# EAGLE design ppm_encoder_402_crystal (EAGLE 5.07)
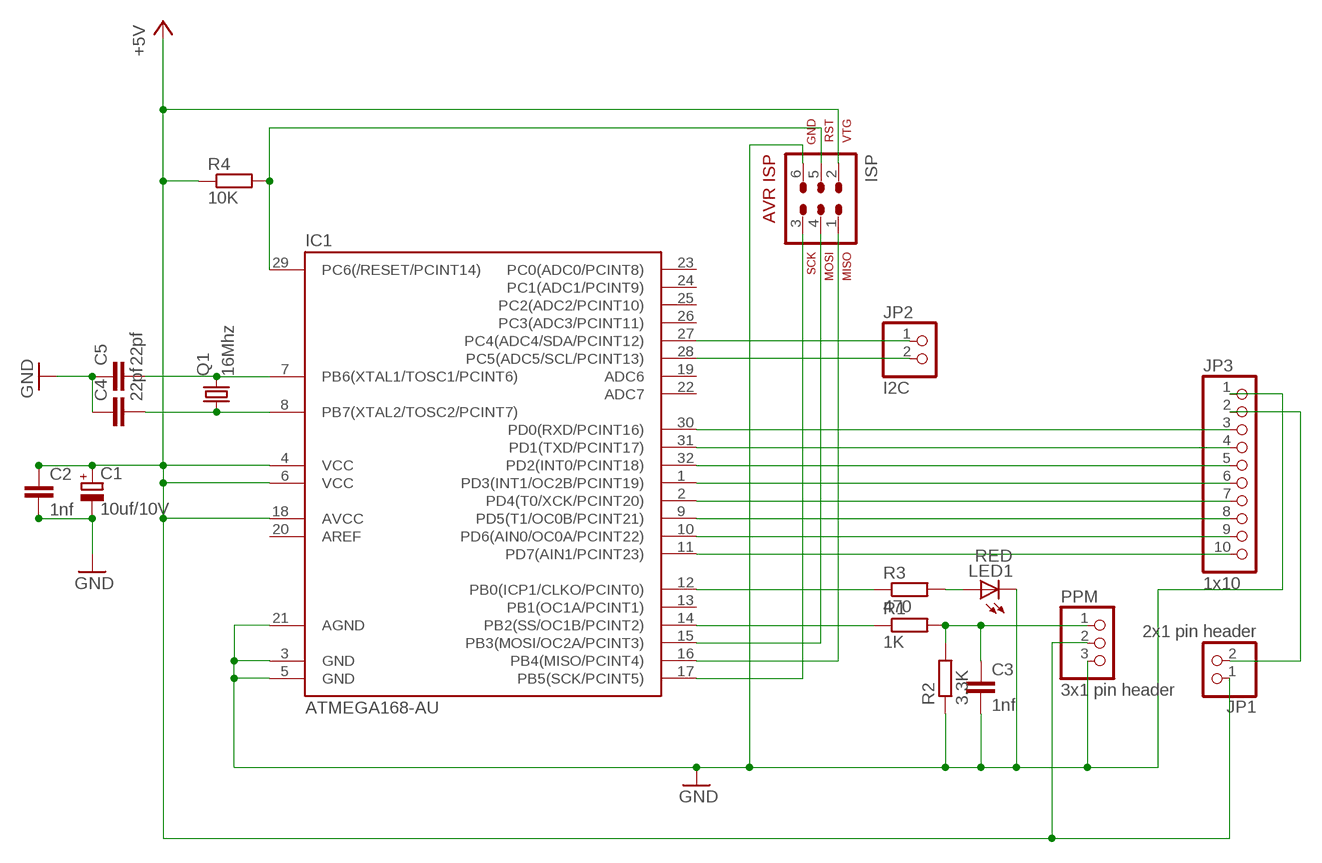
[diagram p0: schematic, sheet 1]

## Parts
C1  10uf/10V  CPOL-EUB/3528-21R  [B/3528-21R]
C2  1nf  C-EUC0402  [C0402]
C3  1nf  C-EUC0402  [C0402]
C4  22pf  C-EUC0402  [C0402]
C5  22pf  C-EUC0402  [C0402]
IC1  ATMEGA168-AU  MEGA48/88/168-AU  [TQFP32-08]
ISP  AVR-ISP-6  [AVR-ISP-6]
JP1  2x1 pin header  PINHD-1X2  [1X02]
JP2  I2C  PINHD-1X2  [1X02]
JP3  1x10  PINHD-1X10/90  [1X10/90]
LED1  RED  LEDCHIP-LED0603  [CHIP-LED0603]
PPM  3x1 pin header  PINHD-1X3  [1X03]
Q1  16Mhz  CRYSTALCTS406  [CTS406]
R1  1K  R-EU_R0402  [R0402]
R2  3.3K  R-EU_R0402  [R0402]
R3  470  R-EU_R0402  [R0402]
R4  10K  R-EU_R0402  [R0402]

## Nets
+5V: C1.+ C2.1 IC1.4(VCC) IC1.6(VCC) IC1.18(AVCC) ISP.2 JP1.1 PPM.2 R4.1
GND: C1.- C2.2 C3.2 C4.1 C5.1 IC1.3(GND) IC1.5(GND) IC1.21(AGND) ISP.6 JP3.1 LED1.C PPM.3 R2.1
N$1: IC1.30(PD0(RXD/PCINT16)) JP3.3
N$2: IC1.31(PD1(TXD/PCINT17)) JP3.4
N$3: IC1.32(PD2(INT0/PCINT18)) JP3.5
N$4: IC1.1(PD3(INT1/OC2B/PCINT19)) JP3.6
N$5: IC1.2(PD4(T0/XCK/PCINT20)) JP3.7
N$6: IC1.9(PD5(T1/OC0B/PCINT21)) JP3.8
N$7: IC1.10(PD6(AIN0/OC0A/PCINT22)) JP3.9
N$8: IC1.11(PD7(AIN1/PCINT23)) JP3.10
N$9: IC1.12(PB0(ICP1/CLKO/PCINT0)) R3.1
N$10: IC1.14(PB2(SS/OC1B/PCINT2)) R1.1
N$11: C3.1 PPM.1 R1.2 R2.2
N$12: LED1.A R3.2
N$13: IC1.16(PB4(MISO/PCINT4)) ISP.1
N$14: IC1.15(PB3(MOSI/OC2A/PCINT3)) ISP.4
N$15: IC1.17(PB5(SCK/PCINT5)) ISP.3
N$16: IC1.29(PC6(/RESET/PCINT14)) ISP.5 R4.2
N$17: C5.2 IC1.7(PB6(XTAL1/TOSC1/PCINT6)) Q1.3
N$18: IC1.28(PC5(ADC5/SCL/PCINT13)) JP2.2
N$19: C4.2 IC1.8(PB7(XTAL2/TOSC2/PCINT7)) Q1.1
N$20: IC1.27(PC4(ADC4/SDA/PCINT12)) JP2.1
N$21: JP1.2 JP3.2
Unconnected: IC1.13(PB1(OC1A/PCINT1)) IC1.19(ADC6) IC1.20(AREF) IC1.22(ADC7) IC1.23(PC0(ADC0/PCINT8)) IC1.24(PC1(ADC1/PCINT9)) IC1.25(PC2(ADC2/PCINT10)) IC1.26(PC3(ADC3/PCINT11))

## Library data of the parts
C1 = rcl:CPOL-EU: POLARIZED CAPACITOR, European symbol
C2-C5 = rcl:C-EU: CAPACITOR, European symbol
IC1 = avr-4:MEGA48/88/168
ISP = avr-4:AVR-ISP-6: AVR ISP-6 Serial Programming Header
JP1 JP2 = pinhead:PINHD-1X2: PIN HEADER
JP3 = pinhead:PINHD-1X10: PIN HEADER
LED1 = led:LED: LED OSRAM: - CHIPLED LG R971, LG N971, LY N971, LG Q971, LY Q971, LO R971, LY R971 LH N974, LH R974 LS Q976, LO Q976, LY Q976 LO Q996 - Hyper CHIPLED LW Q18S LB Q993, LB Q99A, LB R99A - SideLED LS A670, LO A670, LY A670, LG A670, LP A670 LB A673, LV A673, LT A673, LW A673 LH A674 LY A675 LS A676, LA A676, LO A676, LY A676, LW A676 LS A679, LY A679, LG A679 - Hyper Micro SIDELED® LS Y876, LA Y876, LO Y876, LY Y876 LT Y87S - SmartLED LW L88C, LW L88S LB L89C, LB L89S, LG L890 LS L89K, LO L89K, LY L89K LS L896, LA L896, LO L896, LY L896 - TOPLED LS T670, LO T670, LY T670, LG T670, LP T670 LSG T670, LSP T670, LSY T670, LOP T670, LYG T670 LG T671, LOG T671, LSG T671 LB T673, LV T673, LT T673, LW T673 LH T674 LS T676, LA T676, LO T676, LY T676, LB T676, LH T676, LSB T676, LW T676 LB T67C, LV T67C, LT T67C, LS T67K, LO T67K, LY T67K, LW E67C LS E67B, LA E67B, LO E67B, LY E67B, LB E67C, LV E67C, LT E67C LW T67C LS T679, LY T679, LG T679 LS T770, LO T770, LY T770, LG T770, LP T770 LB T773, LV T773, LT T773, LW T773 LH T774 LS E675, LA E675, LY E675, LS T675 LS T776, LA T776, LO T776, LY T776, LB T776 LHGB T686 LT T68C, LB T68C - Hyper Mini TOPLED® LB M676 - Mini TOPLED Santana® LG M470 LS M47K, LO M47K, LY M47K Source: http://www.osram.convergy.de LUXEON: - LUMILED® LXK2-PW12-R00, LXK2-PW12-S00, LXK2-PW14-U00, LXK2-PW14-V00 LXK2-PM12-R00, LXK2-PM12-S00, LXK2-PM14-U00 LXK2-PE12-Q00, LXK2-PE12-R00, LXK2-PE12-S00, LXK2-PE14-T00, LXK2-PE14-U00 LXK2-PB12-K00, LXK2-PB12-L00, LXK2-PB12-M00, LXK2-PB14-N00, LXK2-PB14-P00, LXK2-PB14-Q00 LXK2-PR12-L00, LXK2-PR12-M00, LXK2-PR14-Q00, LXK2-PR14-R00 LXK2-PD12-Q00, LXK2-PD12-R00, LXK2-PD12-S00 LXK2-PH12-R00, LXK2-PH12-S00 LXK2-PL12-P00, LXK2-PL12-Q00, LXK2-PL12-R00 Source: www.luxeon.com KINGBRIGHT: KA-3528ASYC Source: www.kingbright.com
PPM = pinhead:PINHD-1X3: PIN HEADER
Q1 = crystal:CRYSTAL: CRYSTAL
R1-R4 = rcl:R-EU_: RESISTOR, European symbol

## Board
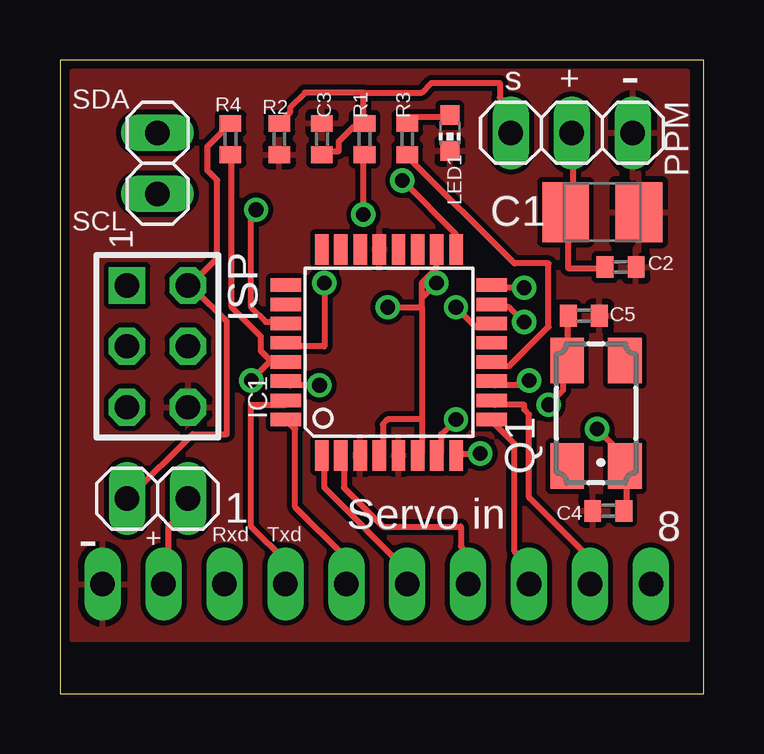
[diagram p1: board, top side]
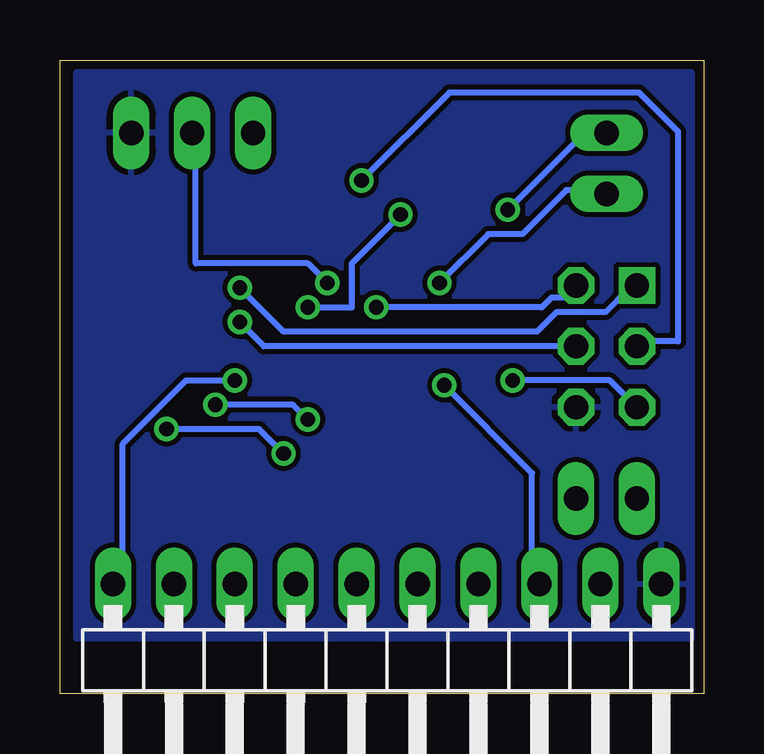
[diagram p2: board, bottom side, seen from below]

Size 26.85 x 26.41 mm. Coordinates in mm from the lower left corner, seen from the top.
Outline: 0,0 26.85,0 26.85,26.41 0,26.41 0,0
Copper layers (1*16): Top 0.035mm / dielectric 1.5mm / Bottom 0.035mm
Design rules "default *": minimum track width 10mil, minimum drill 24mil, track to track 8mil, track to pad 8mil, pad to pad 8mil, via to via 8mil, smd to smd 8mil, copper to edge 10mil, drill to drill 8mil, minimum pad ring 10mil, minimum via ring 8mil, stop-mask expansion 4mil, vias tented up to drill 0mil, thermal gap 10mil

### Footprints (pad centres in the part's own frame; a part is rotated, then mirrored left to right if it is on the bottom)
B/3528-21R = smd 1.95 x 2.5: + 1.525,0; - -1.525,0
C0402 = smd 0.7 x 0.9: 1 -0.65,0; 2 0.65,0
TQFP32-08 = smd 1.27 x 0.559: 1 -4.293,2.8; 2 -4.293,2; 3 -4.293,1.2; 4 -4.293,0.4; 5 -4.293,-0.4; 6 -4.293,-1.2; 7 -4.293,-2; 8 -4.293,-2.8; 17 4.293,-2.8; 18 4.293,-2; 19 4.293,-1.2; 20 4.293,-0.4; 21 4.293,0.4; 22 4.293,1.2; 23 4.293,2; 24 4.293,2.8 | smd 0.559 x 1.27: 9 -2.8,-4.293; 10 -2,-4.293; 11 -1.2,-4.293; 12 -0.4,-4.293; 13 0.4,-4.293; 14 1.2,-4.293; 15 2,-4.293; 16 2.8,-4.293; 25 2.8,4.293; 26 2,4.293; 27 1.2,4.293; 28 0.4,4.293; 29 -0.4,4.293; 30 -1.2,4.293; 31 -2,4.293; 32 -2.8,4.293
AVR-ISP-6 = drill 1.016 square: 1 -2.54,-1.27 | drill 1.016 octagon: 2 -2.54,1.27; 3 0,-1.27; 4 0,1.27; 5 2.54,-1.27; 6 2.54,1.27
1X02 = drill 1.016 long: 1 -1.27,0; 2 1.27,0
1X10/90 = drill 1.016 long: 1 -11.43,-3.81; 2 -8.89,-3.81; 3 -6.35,-3.81; 4 -3.81,-3.81; 5 -1.27,-3.81; 6 1.27,-3.81; 7 3.81,-3.81; 8 6.35,-3.81; 9 8.89,-3.81; 10 11.43,-3.81
CHIP-LED0603 = smd 0.8 x 0.8: A 0,-0.75; C 0,0.75
1X03 = drill 1.016 long: 1 -2.54,0; 2 0,0; 3 2.54,0
CTS406 = smd 1.9 x 1.4: 1 -2.2,-1.2; 2 2.2,-1.2; 3 2.2,1.2; 4 -2.2,1.2
R0402 = smd 0.7 x 0.9: 1 -0.65,0; 2 0.65,0

### Placement (x,y rotation side)
C1  22.61,20.07 180 top
C2  23.37,17.78 0 top
C3  10.92,23.11 90 top
C4  22.86,7.62 0 top
C5  21.84,15.75 180 top
IC1  13.72,14.22 90 top
ISP  4.06,14.48 270 top
JP1  4.06,8.13 0 top
JP2  4.06,22.1 270 top
JP3  13.21,0.76 180 bottom
LED1  16.26,23.37 180 top
PPM  21.34,23.37 0 top
Q1  22.35,11.68 90 top
R1  12.7,23.11 90 top
R2  9.14,23.11 90 top
R3  14.48,23.11 90 top
R4  7.11,23.11 270 top

### Tracks (layer width: path | path; a pad name or v marks a point on that pad's centre or on a via)
+5V  (via drill 0.61)
  Top 0.254: 5.54,17.12 5.33,16.92 ISP.2 5.54,17.12 | 5.54,17.12 6.55,18.14 6.55,21.39 6.15,21.79 6.15,22.81 6.96,23.62 R4.1 | 5.54,17.12 5.54,16.92 6.96,15.49 6.96,10.82 5.54,10.82 2.9,8.18 JP1.1 | C2.1 22.61,17.73 21.18,17.73 21.18,19.96 C1.+ 21.18,20.17 21.39,20.37 21.39,23.22 PPM.2 | 15.09,11.43 13.66,11.43 13.46,11.23 13.46,10.01 IC1.4 | 15.09,11.43 15.09,10.01 IC1.6 | 15.09,16.1 15.09,11.43 | 15.09,16.1 15.09,16.51 | 15.09,16.51 15.09,17.12 15.7,17.73 15.7,18.34 IC1.18 | 15.09,16.51 v15.7,17.12 | v13.66,16.1 15.09,16.1
  Bottom 0.254: v15.7,17.12 16.51,17.93 21.18,17.93 21.18,23.22 PPM.2 | v13.66,16.1 6.76,16.1 6.35,16.51 5.74,16.51 5.33,16.92 ISP.2
GND
  pour Top: 0.51,25.91 0.51,2.29 26.16,2.29 26.16,25.91
  pour Bottom: 0.51,25.91 0.51,2.29 26.16,2.29 26.16,25.91
N$1  (via drill 0.61)
  Top 0.254: v10.82,12.85 9.6,12.85 IC1.30
  Bottom 0.254: v10.82,12.85 7.16,9.19 7.16,4.72 6.96,4.72 JP3.3
N$2
  Top 0.254: IC1.31 9.4,12.04 7.98,12.04 7.98,6.96 9.4,5.54 JP3.4
N$3
  Top 0.254: IC1.32 9.6,11.23 9.8,11.02 9.8,7.77 11.84,5.74 11.84,4.72 JP3.5
N$4
  Top 0.254: IC1.1 11.02,9.8 11.02,8.58 14.48,5.13 JP3.6
N$5
  Top 0.254: IC1.2 11.84,9.8 11.84,8.58 13.46,6.96 16.71,6.96 16.71,6.15 16.92,5.94 16.92,4.72 JP3.7
N$6
  Top 0.254: IC1.9 18.14,11.23 18.95,10.41 18.95,5.94 19.56,5.33 JP3.8
N$7
  Top 0.254: IC1.10 18.14,12.04 19.35,12.04 19.35,11.84 19.56,11.63 19.56,8.18 22,5.74 22,4.72 JP3.9
N$8  (via drill 0.61)
  Top 0.254: v19.56,13.06 19.56,12.85 18.14,12.85 IC1.11
  Bottom 0.254: v19.56,13.06 21.59,13.06 24.23,10.41 24.23,4.72 24.64,4.72 JP3.10
N$9
  Top 0.254: R3.1 14.48,22.4 18.95,17.93 20.37,17.93 20.37,15.29 18.74,13.67 18.14,13.67 IC1.12
N$10  (via drill 0.61)
  Top 0.254: v12.65,19.96 12.65,22.4 R1.1 | v16.51,16.1 17.32,15.29 17.93,15.29 IC1.14
  Bottom 0.254: v12.65,19.96 14.68,17.93 14.68,16.1 v16.51,16.1
N$11
  Top 0.254: C3.1 11.02,22.61 11.63,22.61 11.63,23.01 12.24,23.62 12.65,23.62 R1.2 12.65,23.82 12.65,25.04 | 12.65,25.04 10.21,25.04 9.6,24.43 9.6,24.23 9.2,23.82 R2.2 | 12.65,25.04 15.09,25.04 15.49,25.45 18.34,25.45 18.34,24.84 18.74,24.43 18.74,23.42 PPM.1
N$12
  Top 0.254: LED1.A 16.1,24.03 14.48,24.03 R3.2
N$13  (via drill 0.61)
  Top 0.254: v19.35,16.92 18.14,16.92 IC1.16
  Bottom 0.254: v19.35,16.92 17.53,15.09 6.96,15.09 6.15,15.9 4.11,15.9 3.1,16.92 2.9,16.92 ISP.1
N$14  (via drill 0.61)
  Top 0.254: v19.35,15.49 18.74,16.1 18.14,16.1 IC1.15
  Bottom 0.254: v19.35,15.49 18.34,14.48 ISP.4
N$15  (via drill 0.61)
  Top 0.254: v14.27,21.39 16.51,19.15 16.51,18.54 IC1.17
  Bottom 0.254: v14.27,21.39 10.62,25.04 2.69,25.04 1.07,23.42 1.07,14.68 2.49,14.68 2.69,14.48 ISP.3
N$16  (via drill 0.61)
  Top 0.254: 8.79,13.87 8.38,14.28 8.38,14.88 7.16,16.1 7.16,22.4 R4.2 | 8.79,13.87 9.4,13.87 IC1.29 | v7.98,13.06 8.79,13.87
  Bottom 0.254: v7.98,13.06 3.91,13.06 ISP.5
N$17  (via drill 0.61)
  Top 0.254: C5.2 21.18,15.7 21.18,14.07 Q1.3 20.98,13.87 20.98,12.65 v20.37,12.04 | v16.51,11.43 15.9,10.82 15.9,10.01 IC1.7
  Bottom 0.254: v16.51,11.43 17.12,12.04 v20.37,12.04
N$18  (via drill 0.61)
  Top 0.254: v11.02,17.12 11.02,14.48 9.6,14.48 IC1.28
  Bottom 0.254: v11.02,17.12 8.99,19.15 7.57,19.15 5.74,20.98 4.11,20.98 JP2.2
N$19  (via drill 0.61)
  Top 0.254: C4.2 23.62,7.77 23.62,9.4 Q1.1 23.42,9.6 23.42,10.01 v22.4,11.02 | v17.53,10.01 16.71,10.01 IC1.8
  Bottom 0.254: v17.53,10.01 18.54,11.02 v22.4,11.02
N$20  (via drill 0.61)
  Top 0.254: v8.18,20.17 7.98,19.96 7.98,16.1 8.58,15.49 9.4,15.49 IC1.27
  Bottom 0.254: v8.18,20.17 5.13,23.22 4.11,23.22 JP2.1
N$21
  Top 0.254: JP3.2 4.32,4.72 4.52,4.93 4.52,6.96 5.33,7.77 JP1.2

### Text on the board
tNames: SDA | s | + | - | SCL | 1 | Rxd | 1 | Txd | Servo in | 8 | - | +